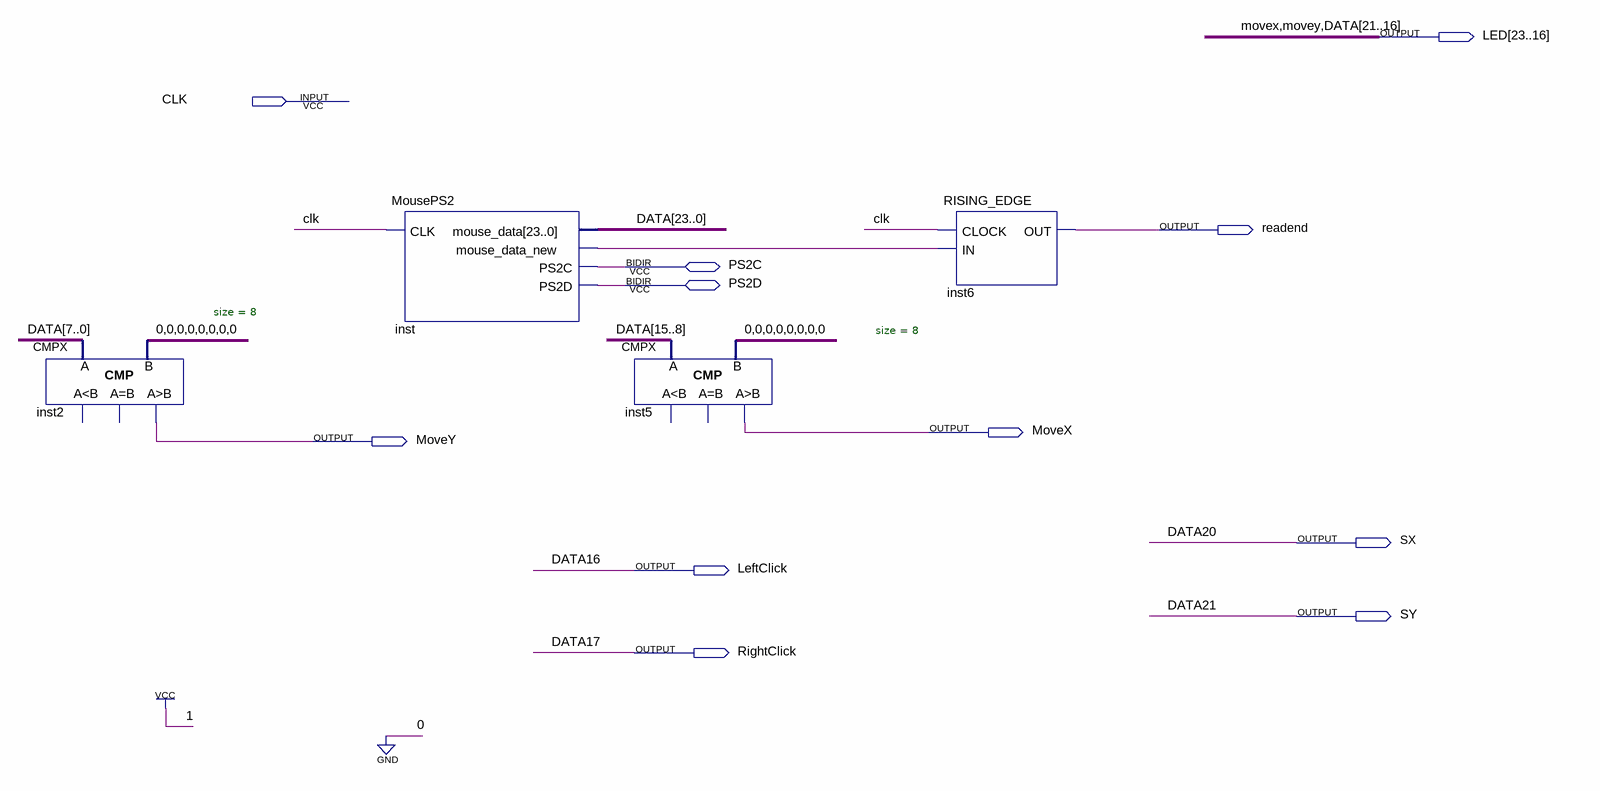
[diagram p0: schematic sheet]
// Quartus schematic Main.bdf as structural Verilog: 4 symbols, 11 pins
module Main (
  input  CLK,
  inout  PS2C,
  inout  PS2D,
  output [23:16] LED,
  output readend,
  output MoveX,
  output MoveY,
  output SX,
  output LeftClick,
  output SY,
  output RightClick
);

  wire inst_mouse_data_new;
  wire [23:0] DATA;

  CMPX #(.size(8)) inst2 (.A(DATA[7:0]), .B({8{1'b0}}), .gr(LED[22]));  // open: ls, eq
  MousePS2 inst (
    .CLK(CLK), .mouse_data({DATA[23:22], LED[21:16], DATA[15:0]}), .mouse_data_new(inst_mouse_data_new),
    .PS2C(PS2C), .PS2D(PS2D));
  CMPX #(.size(8)) inst5 (.A(DATA[15:8]), .B({8{1'b0}}), .gr(LED[23]));  // open: ls, eq
  RISING_EDGE inst6 (.CLOCK(CLK), .IN(inst_mouse_data_new), .OUT(readend));

  assign LeftClick = LED[16];
  assign MoveX = LED[23];
  assign MoveY = LED[22];
  assign RightClick = LED[17];
  assign SX = LED[20];
  assign SY = LED[21];

  // Other names for the same wires on the sheet: DATA[21:16] = LED[21:16]; DATA16 = LED[16]; DATA17 = LED[17];
  //   DATA20 = LED[20]; DATA21 = LED[21]
endmodule
